# Altium schematic sheet [14] Ethernet.SchDoc: Ethernet
size B; DocumentNumber: I; Revision: 01; SheetNumber: 14; SheetTotal: 19
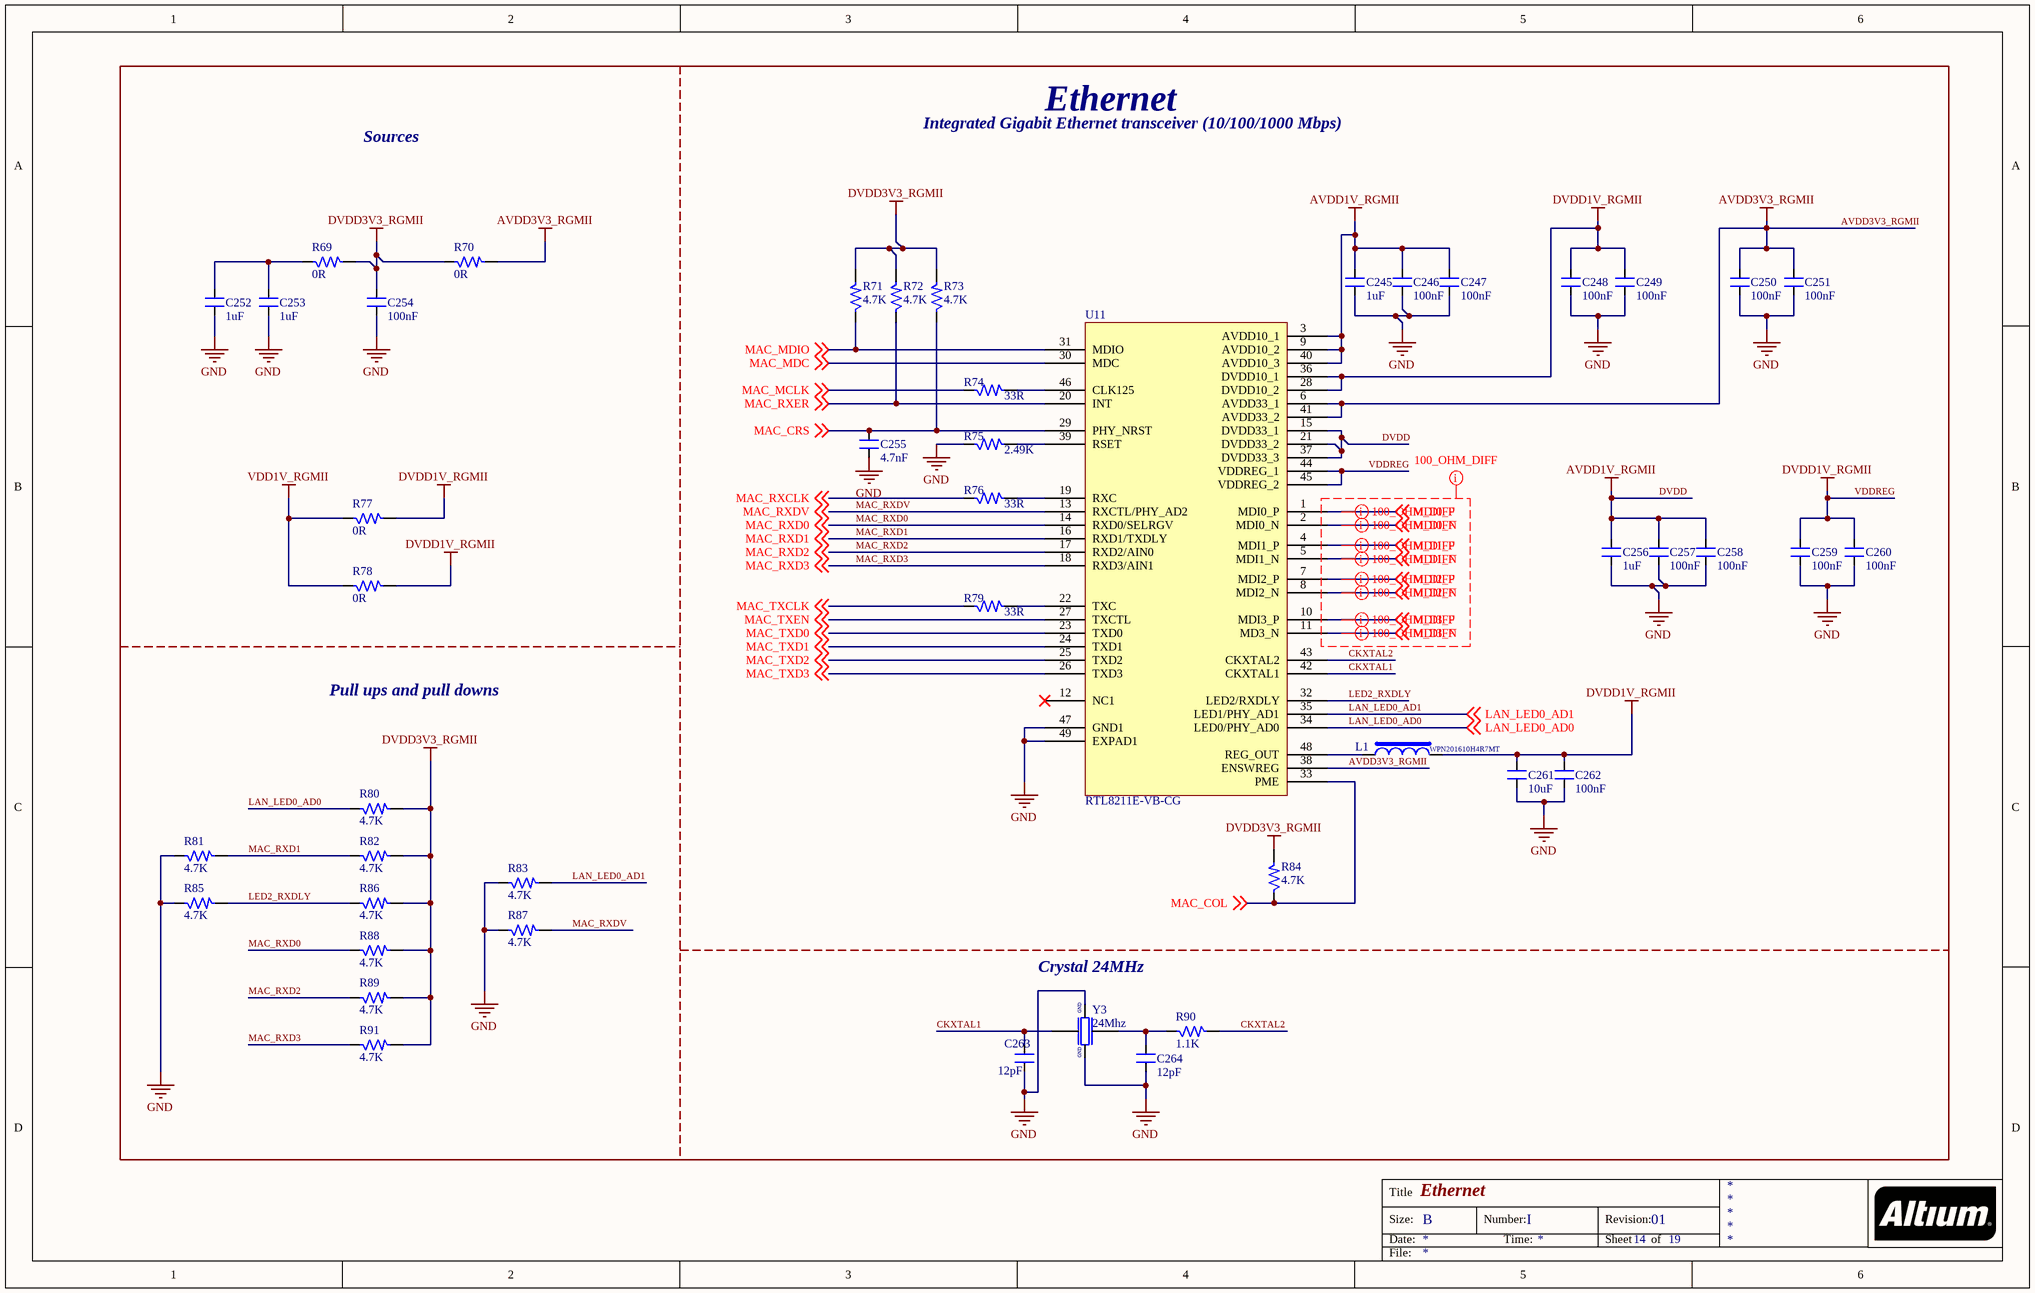
[diagram p0: [14] Ethernet.SchDoc]

## Parts
C245  1uF  [CAP_0201]
C246  100nF  [CAP_0201]
C247  100nF  [CAP_0201]
C248  100nF  [CAP_0201]
C249  100nF  [CAP_0201]
C250  100nF  [CAP_0201]
C251  100nF  [CAP_0201]
C252  1uF  [CAP_0402]
C253  1uF  [CAP_0402]
C254  100nF  [CAP_0201]
C255  4.7nF  [CAP_0201]
C256  1uF  [CAP_0201]
C257  100nF  [CAP_0201]
C258  100nF  [CAP_0201]
C259  100nF  [CAP_0201]
C260  100nF  [CAP_0201]
C261  10uF  [CAP_0402]
C262  100nF  [CAP_0201]
C263  12pF  [CAP_0402]
C264  12pF  [CAP_0402]
L1  WPN201610H4R7MT  [IND_62.9_110X86.6_SMD]
R69  0R  [RES_0201]
R70  0R  [RES_0201]
R71  4.7K  [RES_0201]
R72  4.7K  [RES_0201]
R73  4.7K  [RES_0201]
R74  33R  [RES_0201]
R75  2.49K  [RES_0201]
R76  33R  [RES_0201]
R77  0R  [RES_0201]
R78  0R  [RES_0201]
R79  33R  [RES_0201]
R80  4.7K  [RES_0201]
R81  4.7K  [RES_0201]
R82  4.7K  [RES_0201]
R83  4.7K  [RES_0201]
R84  4.7K  [RES_0201]
R85  4.7K  [RES_0201]
R86  4.7K  [RES_0201]
R87  4.7K  [RES_0201]
R88  4.7K  [RES_0201]
R89  4.7K  [RES_0201]
R90  1.1K  [RES_0201]
R91  4.7K  [RES_0201]
U11  RTL8211E-VB-CG  [QFN48_19.6_324X324_SMD]
Y3  24Mhz  [XTAL_ABM8AIG-24.000MHZ-12-2Z-T3]

## Nets
AVDD3V3_RGMII: C250.2 C251.2 R70.2 U11.6(AVDD33_1) U11.38(ENSWREG) U11.41(AVDD33_2)
DVDD: C245.2 C246.2 C247.2 C256.2 C257.2 C258.2 U11.3(AVDD10_1) U11.9(AVDD10_2) U11.15(DVDD33_1) U11.21(DVDD33_2) U11.37(DVDD33_3) U11.40(AVDD10_3)  [also labelled AVDD1V_RGMII]
DVDD3V3_RGMII: C254.2 R69.2 R70.1 R71.2 R72.2 R73.2 R80.2 R82.2 R84.2 R86.2 R88.2 R89.2 R91.2
GND: C245.1 C246.1 C247.1 C248.1 C249.1 C250.1 C251.1 C252.1 C253.1 C254.1 C255.1 C256.1 C257.1 C258.1 C259.1 C260.1 C261.1 C262.1 C263.1 C264.1 R75.1 R81.1 R83.1 R85.1 R87.1 U11.47(GND1) U11.49(EXPAD1) Y3.2 Y3.4
VDD1V_RGMII: R77.1 R78.1
VDDREG: C248.2 C249.2 C259.2 C260.2 C261.2 C262.2 L1.2 R77.2 R78.2 U11.28(DVDD10_2) U11.36(DVDD10_1) U11.44(VDDREG_1) U11.45(VDDREG_2)  [also labelled DVDD1V_RGMII]
CKXTAL1: C263.2 U11.42(CKXTAL1) Y3.1
CKXTAL2: R90.2 U11.43(CKXTAL2)
LAN_LED0_AD0: R80.1 U11.34(LED0/PHY_AD0) ; off-sheet LAN_LED0_AD0
LAN_LED0_AD1: R83.2 U11.35(LED1/PHY_AD1) ; off-sheet LAN_LED0_AD1
LED2_RXDLY: R85.2 R86.1 U11.32(LED2/RXDLY)
MAC_COL: R84.1 U11.33(PME) ; off-sheet MAC_COL
MAC_CRS: C255.2 R73.1 U11.29(PHY_NRST) ; off-sheet MAC_CRS
MAC_MCLK: R74.1 ; off-sheet MAC_MCLK
MAC_MDC: U11.30(MDC) ; off-sheet MAC_MDC
MAC_MDIO: R71.1 U11.31(MDIO) ; off-sheet MAC_MDIO
MAC_RXCLK: R76.1 ; off-sheet MAC_RXCLK
MAC_RXD0: R88.1 U11.14(RXD0/SELRGV) ; off-sheet MAC_RXD0
MAC_RXD1: R81.2 R82.1 U11.16(RXD1/TXDLY) ; off-sheet MAC_RXD1
MAC_RXD2: R89.1 U11.17(RXD2/AIN0) ; off-sheet MAC_RXD2
MAC_RXD3: R91.1 U11.18(RXD3/AIN1) ; off-sheet MAC_RXD3
MAC_RXDV: R87.2 U11.13(RXCTL/PHY_AD2) ; off-sheet MAC_RXDV
MAC_RXER: R72.1 U11.20(INT) ; off-sheet MAC_RXER
MAC_TXCLK: R79.1 ; off-sheet MAC_TXCLK
MAC_TXD0: U11.23(TXD0) ; off-sheet MAC_TXD0
MAC_TXD1: U11.24(TXD1) ; off-sheet MAC_TXD1
MAC_TXD2: U11.25(TXD2) ; off-sheet MAC_TXD2
MAC_TXD3: U11.26(TXD3) ; off-sheet MAC_TXD3
MAC_TXEN: U11.27(TXCTL) ; off-sheet MAC_TXEN
MDI0_N: U11.2(MDI0_N) ; off-sheet MDI0_N
MDI0_P: U11.1(MDI0_P) ; off-sheet MDI0_P
MDI1_N: U11.5(MDI1_N) ; off-sheet MDI1_N
MDI1_P: U11.4(MDI1_P) ; off-sheet MDI1_P
MDI2_N: U11.8(MDI2_N) ; off-sheet MDI2_N
MDI2_P: U11.7(MDI2_P) ; off-sheet MDI2_P
MDI3_N: U11.11(MD3_N) ; off-sheet MDI3_N
MDI3_P: U11.10(MDI3_P) ; off-sheet MDI3_P
NetC252_2: C252.2 C253.2 R69.1
NetC264_2: C264.2 R90.1 Y3.3
NetL1_1: L1.1 U11.48(REG_OUT)
NetR74_2: R74.2 U11.46(CLK125)
NetR75_2: R75.2 U11.39(RSET)
NetR76_2: R76.2 U11.19(RXC)
NetR79_2: R79.2 U11.22(TXC)

Not connected (* = marked no-connect by the designer): U11 12(NC1)*

## Layout directives
differential pair: MDI0_N, MDI0_P, MDI1_N, MDI1_P, MDI2_N, MDI2_P, MDI3_N, MDI3_P
mark named 100_OHM_DIFF: MDI0_N, MDI0_P, MDI1_N, MDI1_P, MDI2_N, MDI2_P, MDI3_N, MDI3_P

## Notes on the sheet
- Sources
- Integrated Gigabit Ethernet transceiver (10/100/1000 Mbps)
- Ethernet
- Pull ups and pull downs
- Crystal 24MHz
- Title
- Size:
- Date:
- B
- Number:
- Time:
- Revision:
- Sheet
- of
- File:
- (in symbol XTAL_24Mhz-12pF-4-SMD) GND

## Library data of the parts
C245 C256 = CAP_1uF-16V-10%-0201: 1µF ±20% 16V Ceramic Capacitor X5R 0201 (0603 Metric) /; Manufacturer: Samsung Electro-Mechanics; Manufacturer Part Number: CL03A105MO3NRNH; Case/Package: 0201; Supplier-1: Digikey
C246-C251 C254 C257-C260 C262 = CAP_100nF-25V-10%-0201: 0.1µF ±10% 25V Ceramic Capacitor X5R 0201 (0603 Metric) /; Manufacturer: TDK Corporation; Manufacturer Part Number: C0603X5R1E104K030BB; Case/Package: 0201; Supplier-1: Digikey
C252 C253 = CAP_1uF-16V-10%-0402: 1µF ±10% 16V Ceramic Capacitor X5R 0402 (1005 Metric) /; Manufacturer: Knowles Novacap; Manufacturer Part Number: 0402BW105K160YT; Case/Package: 0402; Supplier-1: Digikey
C255 = CAP_4.7nF-10V-10%-0201: 4700pF ±10% 10V Ceramic Capacitor X7R 0201 (0603 Metric) /; Manufacturer: AVX Corporation; Manufacturer Part Number: 0201ZC472KAT2A; Case/Package: 0201; Supplier-1: Digikey
C261 = CAP_10uF-10V-20%-0402: 10µF ±20% 10V Ceramic Capacitor X5R 0402 (1005 Metric) /; Manufacturer Part Number: CL05A106MP5NUNC; Manufacturer: Samsung Electro-Mechanics; Case/Package: 0402; Supplier-1: Digikey
C263 C264 = CAP_12pF-10V-10%-0402: 12pF ±10% 10V Ceramic Capacitor X8R 0402 (1005 Metric) /; Manufacturer: KEMET; Manufacturer Part Number: C0402C120K8HAC7867; Case/Package: 0402; Supplier-1: Digikey
L1 = IND_4.7uH-0.9A-20%-SMD: 4.7uH ±20% 900mA 425mΩ SMD,2.0x1.6x1.0mm Power Inductors RoHS /; Manufacturer: Sunlord; Manufacturer Part Number: WPN201610H4R7MT; Case/Package: SMD; Supplier-1: LCSC
R69 R70 R77 R78 = RES_0R-0.05W-1%-0201: 0 Ohms Jumper 0.05W, 1/20W Chip Resistor 0201 (0603 Metric) Automotive AEC-Q200 Thick Film; Manufacturer: Bourns Inc.; Manufacturer Part Number: CR0201AJ/-000GLF; Case/Package: 0201; Supplier-1: Digikey
R71-R73 R80-R89 R91 = RES_4.7K-0.1W-1%-0201: 4.02 kOhms ±1% 0.05W, 1/20W Chip Resistor 0201 (0603 Metric) Thick Film /; Manufacturer: Yageo; Manufacturer Part Number: RC0201FR-074K02L; Case/Package: 0201; Supplier-1: Digikey
R74 R76 R79 = RES_33R-0.05W-1%-0201: 33 Ohms ±1% 0.05W, 1/20W Chip Resistor 0201 (0603 Metric) Thick Film /; Manufacturer: Yageo; Manufacturer Part Number: RC0201FR-0733RL; Case/Package: 0201; Supplier-1: Digikey
R75 = RES_2.49K-0.05W-1%-0201: 2.49 kOhms ±1% 0.05W, 1/20W Chip Resistor 0201 (0603 Metric) Automotive AEC-Q200 Thick Film /; Manufacturer: Panasonic Electronic Components; Manufacturer Part Number: ERJ-1GNF2491C; Case/Package: 0201; Supplier-1: Digikey
R90 = RES_1.1K-0.05W-1%-0201: 1.1 kOhms ±1% 0.05W, 1/20W Chip Resistor 0201 (0603 Metric) Automotive AEC-Q200 Thick Film /; Manufacturer: Panasonic Electronic Components; Manufacturer Part Number: ERJ-1GNF1101C; Case/Package: 0201; Supplier-1: Digikey
U11 = IC_RTL8211E-VB-CG: Ethernet Transceivers 10/100/1000 Base-T PHY GMII, MII, RGMII 1.43V ~ 3.63V QFN-48_6x6x04P Ethernet ICs RoHS; Manufacturer: Realtek Semicon; Manufacturer Part Number: RTL8211E-VB-CG; Case/Package: QFN-48; Supplier-1: LCSC
Y3 = XTAL_24Mhz-12pF-4-SMD: 24MHz ±20ppm Crystal 12pF 50 Ohms 4-SMD, No Lead /; Manufacturer: Abracon LLC; Manufacturer Part Number: ABM8AIG-24.000MHZ-12-2Z-T3; Case/Package: SMD; Supplier-1: Digikey